# EAGLE schematic axiom_beta_power_board_v1.25 (EAGLE 7.7.0), part 2 of 2
## Sheet 14 of 14
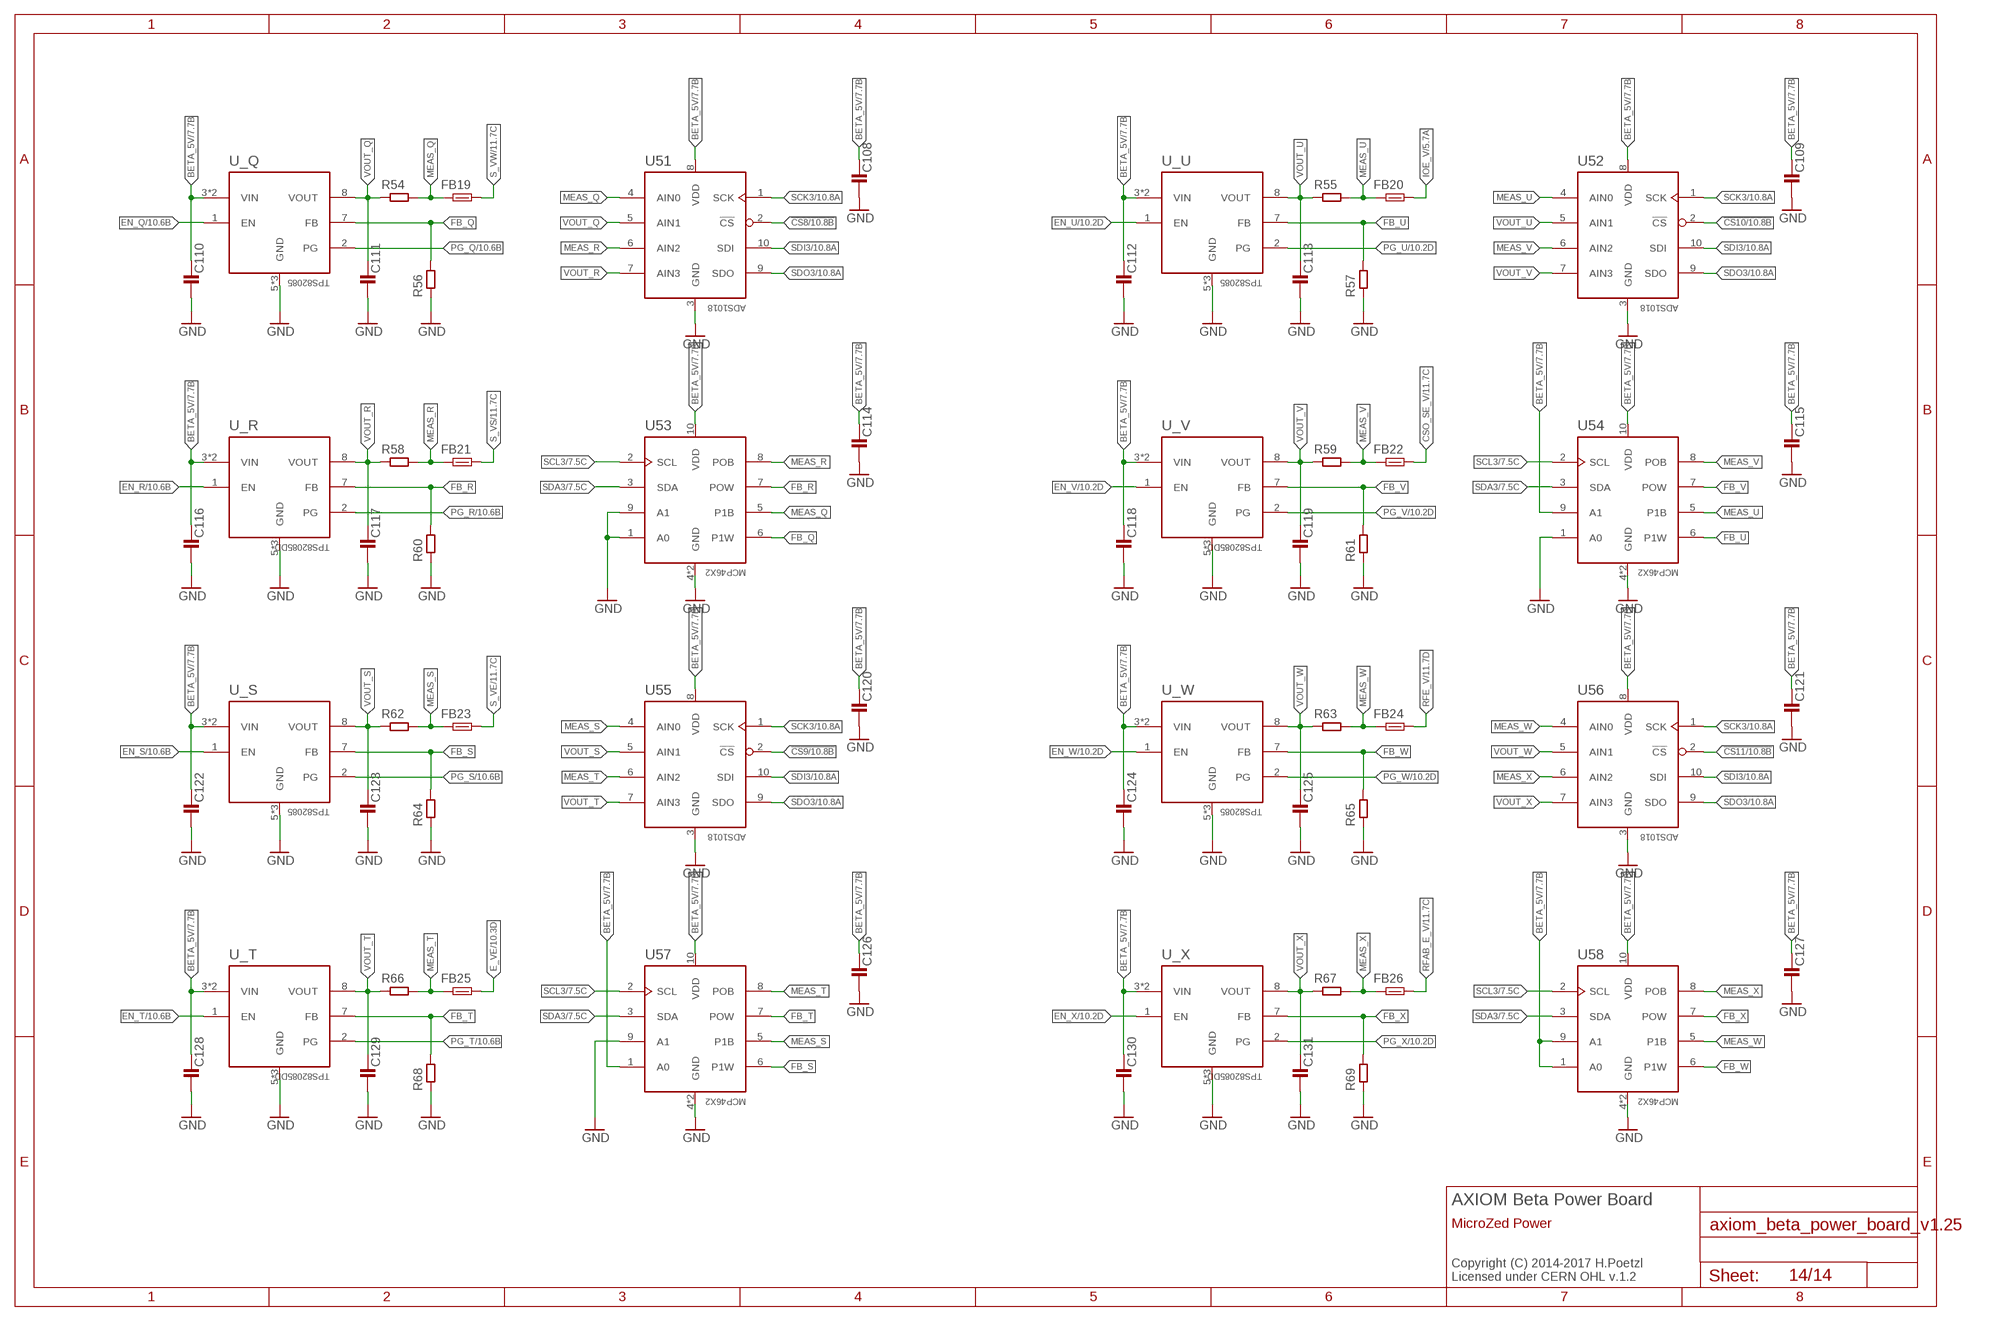
[diagram p13: schematic, sheet 14]

### Parts
C108  C0402-C  [0402-C]
C109  C0402-C  [0402-C]
C110  C0603-C  [0603-C]
C111  C0603-C  [0603-C]
C112  C0603-C  [0603-C]
C113  C0603-C  [0603-C]
C114  C0402-C  [0402-C]
C115  C0402-C  [0402-C]
C116  C0603-C  [0603-C]
C117  C0603-C  [0603-C]
C118  C0603-C  [0603-C]
C119  C0603-C  [0603-C]
C120  C0402-C  [0402-C]
C121  C0402-C  [0402-C]
C122  C0603-C  [0603-C]
C123  C0603-C  [0603-C]
C124  C0603-C  [0603-C]
C125  C0603-C  [0603-C]
C126  C0402-C  [0402-C]
C127  C0402-C  [0402-C]
C128  C0603-C  [0603-C]
C129  C0603-C  [0603-C]
C130  C0603-C  [0603-C]
C131  C0603-C  [0603-C]
FB19  FB0603-C  [0603-C]
FB20  FB0603-C  [0603-C]
FB21  FB0603-C  [0603-C]
FB22  FB0603-C  [0603-C]
FB23  FB0603-C  [0603-C]
FB24  FB0603-C  [0603-C]
FB25  FB0603-C  [0603-C]
FB26  FB0603-C  [0603-C]
R54  R0603-C  [0603-C]
R55  R0603-C  [0603-C]
R56  R0402-C  [0402-C]
R57  R0402-C  [0402-C]
R58  R0603-C  [0603-C]
R59  R0603-C  [0603-C]
R60  R0402-C  [0402-C]
R61  R0402-C  [0402-C]
R62  R0603-C  [0603-C]
R63  R0603-C  [0603-C]
R64  R0402-C  [0402-C]
R65  R0402-C  [0402-C]
R66  R0603-C  [0603-C]
R67  R0603-C  [0603-C]
R68  R0402-C  [0402-C]
R69  R0402-C  [0402-C]
U51  ADS1018  [X2QFN-10]
U52  ADS1018  [X2QFN-10]
U53  MCP46X2  [DFN-10]
U54  MCP46X2  [DFN-10]
U55  ADS1018  [X2QFN-10]
U56  ADS1018  [X2QFN-10]
U57  MCP46X2  [DFN-10]
U58  MCP46X2  [DFN-10]
U_Q  TPS82085  [MICROSIP]
U_R  TPS82085DD  [MICROSIP-DD]
U_S  TPS82085  [MICROSIP]
U_T  TPS82085DD  [MICROSIP-DD]
U_U  TPS82085  [MICROSIP]
U_V  TPS82085DD  [MICROSIP-DD]
U_W  TPS82085  [MICROSIP]
U_X  TPS82085DD  [MICROSIP-DD]

### Nets
!CS8: U51.2(!CS) ; also sheet 10
!CS9: U55.2(!CS) ; also sheet 10
!CS10: U52.2(!CS) ; also sheet 10
!CS11: U56.2(!CS) ; also sheet 10
BETA_5V: C108.1 C109.1 C110.1 C112.1 C114.1 C115.1 C116.1 C118.1 C120.1 C121.1 C122.1 C124.1 C126.1 C127.1 C128.1 C130.1 U51.8(VDD) U52.8(VDD) U53.10(VDD) U54.9(A1) U54.10(VDD) U55.8(VDD) U56.8(VDD) U57.1(A0) U57.10(VDD) U58.1(A0) U58.9(A1) U58.10(VDD) U_Q.3(VIN) U_Q.4(VIN) U_R.3(VIN) U_R.4(VIN) U_S.3(VIN) U_S.4(VIN) U_T.3(VIN) U_T.4(VIN) U_U.3(VIN) U_U.4(VIN) U_V.3(VIN) U_V.4(VIN) U_W.3(VIN) U_W.4(VIN) U_X.3(VIN) U_X.4(VIN) ; also sheet 7,8,9,10,12,13
CSO_SE_V: FB22.2 ; also sheet 11
E_VE: FB25.2 ; also sheet 10,11
EN_Q: U_Q.1(EN) ; also sheet 10
EN_R: U_R.1(EN) ; also sheet 10
EN_S: U_S.1(EN) ; also sheet 10
EN_T: U_T.1(EN) ; also sheet 10
EN_U: U_U.1(EN) ; also sheet 10
EN_V: U_V.1(EN) ; also sheet 10
EN_W: U_W.1(EN) ; also sheet 10
EN_X: U_X.1(EN) ; also sheet 10
FB_Q: R56.2 U53.6(P1W) U_Q.7(FB)
FB_R: R60.2 U53.7(POW) U_R.7(FB)
FB_S: R64.2 U57.6(P1W) U_S.7(FB)
FB_T: R68.2 U57.7(POW) U_T.7(FB)
FB_U: R57.2 U54.6(P1W) U_U.7(FB)
FB_V: R61.2 U54.7(POW) U_V.7(FB)
FB_W: R65.2 U58.6(P1W) U_W.7(FB)
FB_X: R69.2 U58.7(POW) U_X.7(FB)
GND: C108.2 C109.2 C110.2 C111.2 C112.2 C113.2 C114.2 C115.2 C116.2 C117.2 C118.2 C119.2 C120.2 C121.2 C122.2 C123.2 C124.2 C125.2 C126.2 C127.2 C128.2 C129.2 C130.2 C131.2 R56.1 R57.1 R60.1 R61.1 R64.1 R65.1 R68.1 R69.1 U51.3(GND) U52.3(GND) U53.1(A0) U53.4(GND) U53.9(A1) U53.EP(GND) U54.1(A0) U54.4(GND) U54.EP(GND) U55.3(GND) U56.3(GND) U57.4(GND) U57.9(A1) U57.EP(GND) U58.4(GND) U58.EP(GND) U_Q.5(GND) U_Q.6(GND) U_Q.EP(GND) U_R.5(GND) U_R.6(GND) U_R.EP(GND) U_S.5(GND) U_S.6(GND) U_S.EP(GND) U_T.5(GND) U_T.6(GND) U_T.EP(GND) U_U.5(GND) U_U.6(GND) U_U.EP(GND) U_V.5(GND) U_V.6(GND) U_V.EP(GND) U_W.5(GND) U_W.6(GND) U_W.EP(GND) U_X.5(GND) U_X.6(GND) U_X.EP(GND) ; also sheet 2,3,5,6,7,8,9,10,11,12,13
IOE_V: FB20.2 ; also sheet 5,11
MEAS_Q: FB19.1 R54.2 U51.4(AIN0) U53.5(P1B)
MEAS_R: FB21.1 R58.2 U51.6(AIN2) U53.8(POB)
MEAS_S: FB23.1 R62.2 U55.4(AIN0) U57.5(P1B)
MEAS_T: FB25.1 R66.2 U55.6(AIN2) U57.8(POB)
MEAS_U: FB20.1 R55.2 U52.4(AIN0) U54.5(P1B)
MEAS_V: FB22.1 R59.2 U52.6(AIN2) U54.8(POB)
MEAS_W: FB24.1 R63.2 U56.4(AIN0) U58.5(P1B)
MEAS_X: FB26.1 R67.2 U56.6(AIN2) U58.8(POB)
PG_Q: U_Q.2(PG) ; also sheet 10
PG_R: U_R.2(PG) ; also sheet 10
PG_S: U_S.2(PG) ; also sheet 10
PG_T: U_T.2(PG) ; also sheet 10
PG_U: U_U.2(PG) ; also sheet 10
PG_V: U_V.2(PG) ; also sheet 10
PG_W: U_W.2(PG) ; also sheet 10
PG_X: U_X.2(PG) ; also sheet 10
RFAB_E_V: FB26.2 ; also sheet 11
RFE_V: FB24.2 ; also sheet 11
S_VE: FB23.2 ; also sheet 11
S_VS: FB21.2 ; also sheet 11
S_VW: FB19.2 ; also sheet 11
SCK3: U51.1(SCK) U52.1(SCK) U55.1(SCK) U56.1(SCK) ; also sheet 10
SCL3: U53.2(SCL) U54.2(SCL) U57.2(SCL) U58.2(SCL) ; also sheet 7,10
SDA3: U53.3(SDA) U54.3(SDA) U57.3(SDA) U58.3(SDA) ; also sheet 7,10
SDI3: U51.10(SDI) U52.10(SDI) U55.10(SDI) U56.10(SDI) ; also sheet 10
SDO3: U51.9(SDO) U52.9(SDO) U55.9(SDO) U56.9(SDO) ; also sheet 10
VOUT_Q: C111.1 R54.1 U51.5(AIN1) U_Q.8(VOUT)
VOUT_R: C117.1 R58.1 U51.7(AIN3) U_R.8(VOUT)
VOUT_S: C123.1 R62.1 U55.5(AIN1) U_S.8(VOUT)
VOUT_T: C129.1 R66.1 U55.7(AIN3) U_T.8(VOUT)
VOUT_U: C113.1 R55.1 U52.5(AIN1) U_U.8(VOUT)
VOUT_V: C119.1 R59.1 U52.7(AIN3) U_V.8(VOUT)
VOUT_W: C125.1 R63.1 U56.5(AIN1) U_W.8(VOUT)
VOUT_X: C131.1 R67.1 U56.7(AIN3) U_X.8(VOUT)

### Notes on the sheet
- AXIOM Beta Power Board
- MicroZed Power
- Copyright (C) 2014-2017 H.Poetzl
  Licensed under CERN OHL v.1.2

## Power pins joined to a net without a drawn wire
GND: U25.1(GND) U25.EP(GND)
VOUT3V3: U5.10(VOUT3V3)

## Library data of the parts
BETA ZED = microzed:µZ-FCI
C1-C131 = generic-rcl:C
CNW CSE = spx3819:SPX3819M5-L: 500mA, LOW-NOISE LDO VOLTAGE REGULATOR; MPN: SPX3819M5-L; OC_FARNELL: 1831948; OC_NEWARK: 23R9689; PACKAGE: SOT-23-5; SUPPLIER: EXAR
D1 D2 R1-R19 R22-R69 = generic-rcl:R
D3 D4 = pmeg2010beld:PMEG2010BELD
F1-F8 = fiducial:FIDUCIAL: Fiducials
FB1-FB26 = generic-rcl:FB
IO_C IO_E IO_W = microchip-exp:MCP23018: http://ww1.microchip.com/downloads/en/DeviceDoc/22103a.pdf Source: http://ww1.microchip.com/downloads/en/DeviceDoc/22103a.pdf Adopted by RobG
IOC PC_C PC_E PC_W = pic16f15386:PIC16F15386
JP1 = pinhead-2:PINHD-2X02: PIN HEADER
LED = led:RGB-LED
LOGO2 = ohw-logo:OSHW_LOGO_FILL
PB-NW PB-SE = df12:DF12(XX)-20DP-0.5V
PWR-NE PWR-NW PWR-SE PWR-SW = pincon:PINRC-2X04: WR-PHD 2.54mm SMT Dual Socket Header Bottom Entry, 8 Pins=>Code : Con_BTB_SHD_2.54_2_610008243021 <http://katalog.we-online.de/media/images/eican/Con_BTB_SHD_2.54_2_6100xx243021_pf2.jpg> Details see: http://katalog.we-online.de/en/em/610_0xx_243_021 Created 2014-05-30, Karrer Zheng 2014 (C) Würth Elektronik
RN1 RN2 = resistor-dil:4R-N: Array Chip Resistor Source: RS Component / Phycomp; OC_FARNELL: unknown; OC_NEWARK: unknown
RN3-RN13 = resistor-dil:2R-N: Array Chip Resistor Source: Panasonic; OC_FARNELL: unknown; OC_NEWARK: unknown
S1 = switch:SKSNLAE010
SD1 = micro-sd:MICRO-SD-2CD
U1 = lvltrans:TXS0102
U2 U3 = gtl2002:PCA9306: Bidirectional low voltage translator,SOIC-8
U4 = emifil:IP4251CZ16-8-TTL: passive filter network; MPN: IP4251CZ16-8-TTL; OC_FARNELL: 1972684; OC_NEWARK: 58T9585; PACKAGE: SON-16; SUPPLIER: NXP
U5 = ft23x:FT231
U6 U9 = mcp4728:MCP4728-E/UN: IC, DAC, 12BIT, QUAD; MPN: MCP4728-E/UN; OC_FARNELL: 1800217; OC_NEWARK: 08R1808; PACKAGE: MSOP-10; SUPPLIER: MICROCHIP
U7 U10 = lm75:LM75: Digital temperature sensor and thermal watchdog
U8 = lvltrans:FXLH1T45
U11 U12 = AP22966:AP22966: Buck/Boost Charge Pump 60mA
U13 U16 U19 = load_switch:MIC94040: Voltage Regulator LDO Standard 150mA LDO voltage regulator in SOT-23 layout. Micrel part MIC5205. BP (by-pass) pin is used to lower output noise with 470pF cap.
U14 U22 = ntlud4c26n:NTLUD4C26N
U15 U25 = ltc4365:LTC4365: IC, DAC, 12BIT, QUAD
U17 U18 U21 = pmeg2020cpas:PMEG2020CPAS
U20 = lt1965:LT1965: Low Dropout Regulator
U23 = pac1720:PAC1720
U27 U28 = mcp23009:MCP23009: IC, I/O EXPANDER, 8BIT, 3.4MHZ,
U29-U34 = ldo:LDO_DUAL: Dual Output SOT23-6 Linear Regulators Diodes Inc. AP7312 - Dual 150mA LDO Linear Regulator 0.2V dropout, 150mA output, 2-6V Input AP7312-1833W6-7 - 1.8V/3.3V SOT23-6 (Digikey: AP7312-1833W6-7DICT-ND) MIC5320 - Dual 150mA ULDO Linear Regulator Ultra-low 35mV dropout at 150mA, 2.3-5.5V Input 3.3V/1.8V SOT23-6 (Digikey: 576-1658-1-ND) 3.3V/1.5V SOT23-6 (Digikey: 576-3483-1-ND)
U35 U36 U39 U40 U43 U44 U47 U48 U51 U52 U55 U56 = ADS1x18:ADS1018: Buck/Boost Charge Pump 60mA
U37 U38 U41 U42 U45 U46 U49 U50 U53 U54 U57 U58 = digipot:MCP46X2: I2C Dual Rheostat 2.3-5.5V MCP4632 129 Taps, Volatile MCP4642 129 Taps, EEPROM MCP4652 257 Taps, Volatile MCP4662 257 Taps, EEPROM
U59 = microchip:24*00: Serial EEPROM 128 bit, I2C (AA = 1.8 V/LC = 2.5 V/C = 5.0 V); MF: MICROCHIP; MPN: 24AA00T-I/OTG; OC_FARNELL: 1331264; OC_NEWARK: 89H3038
U_I U_J U_K U_L U_M U_N U_O U_P U_Q U_R U_S U_T U_U U_V U_W U_X UA UB UC UD UE UF UG UH = TPS82085:TPS82085: Buck/Boost Charge Pump 60mA
USB = usb:5_USB_3S; TE: 1981584
X1 = pico-spox:PICO-SPOX-5

## Net classes
1 LVDS: width 0.152 mm, drill 0.203 mm, clearance 0.152 mm